# EAGLE design mayfly_platform_reva (EAGLE 7.2.0)
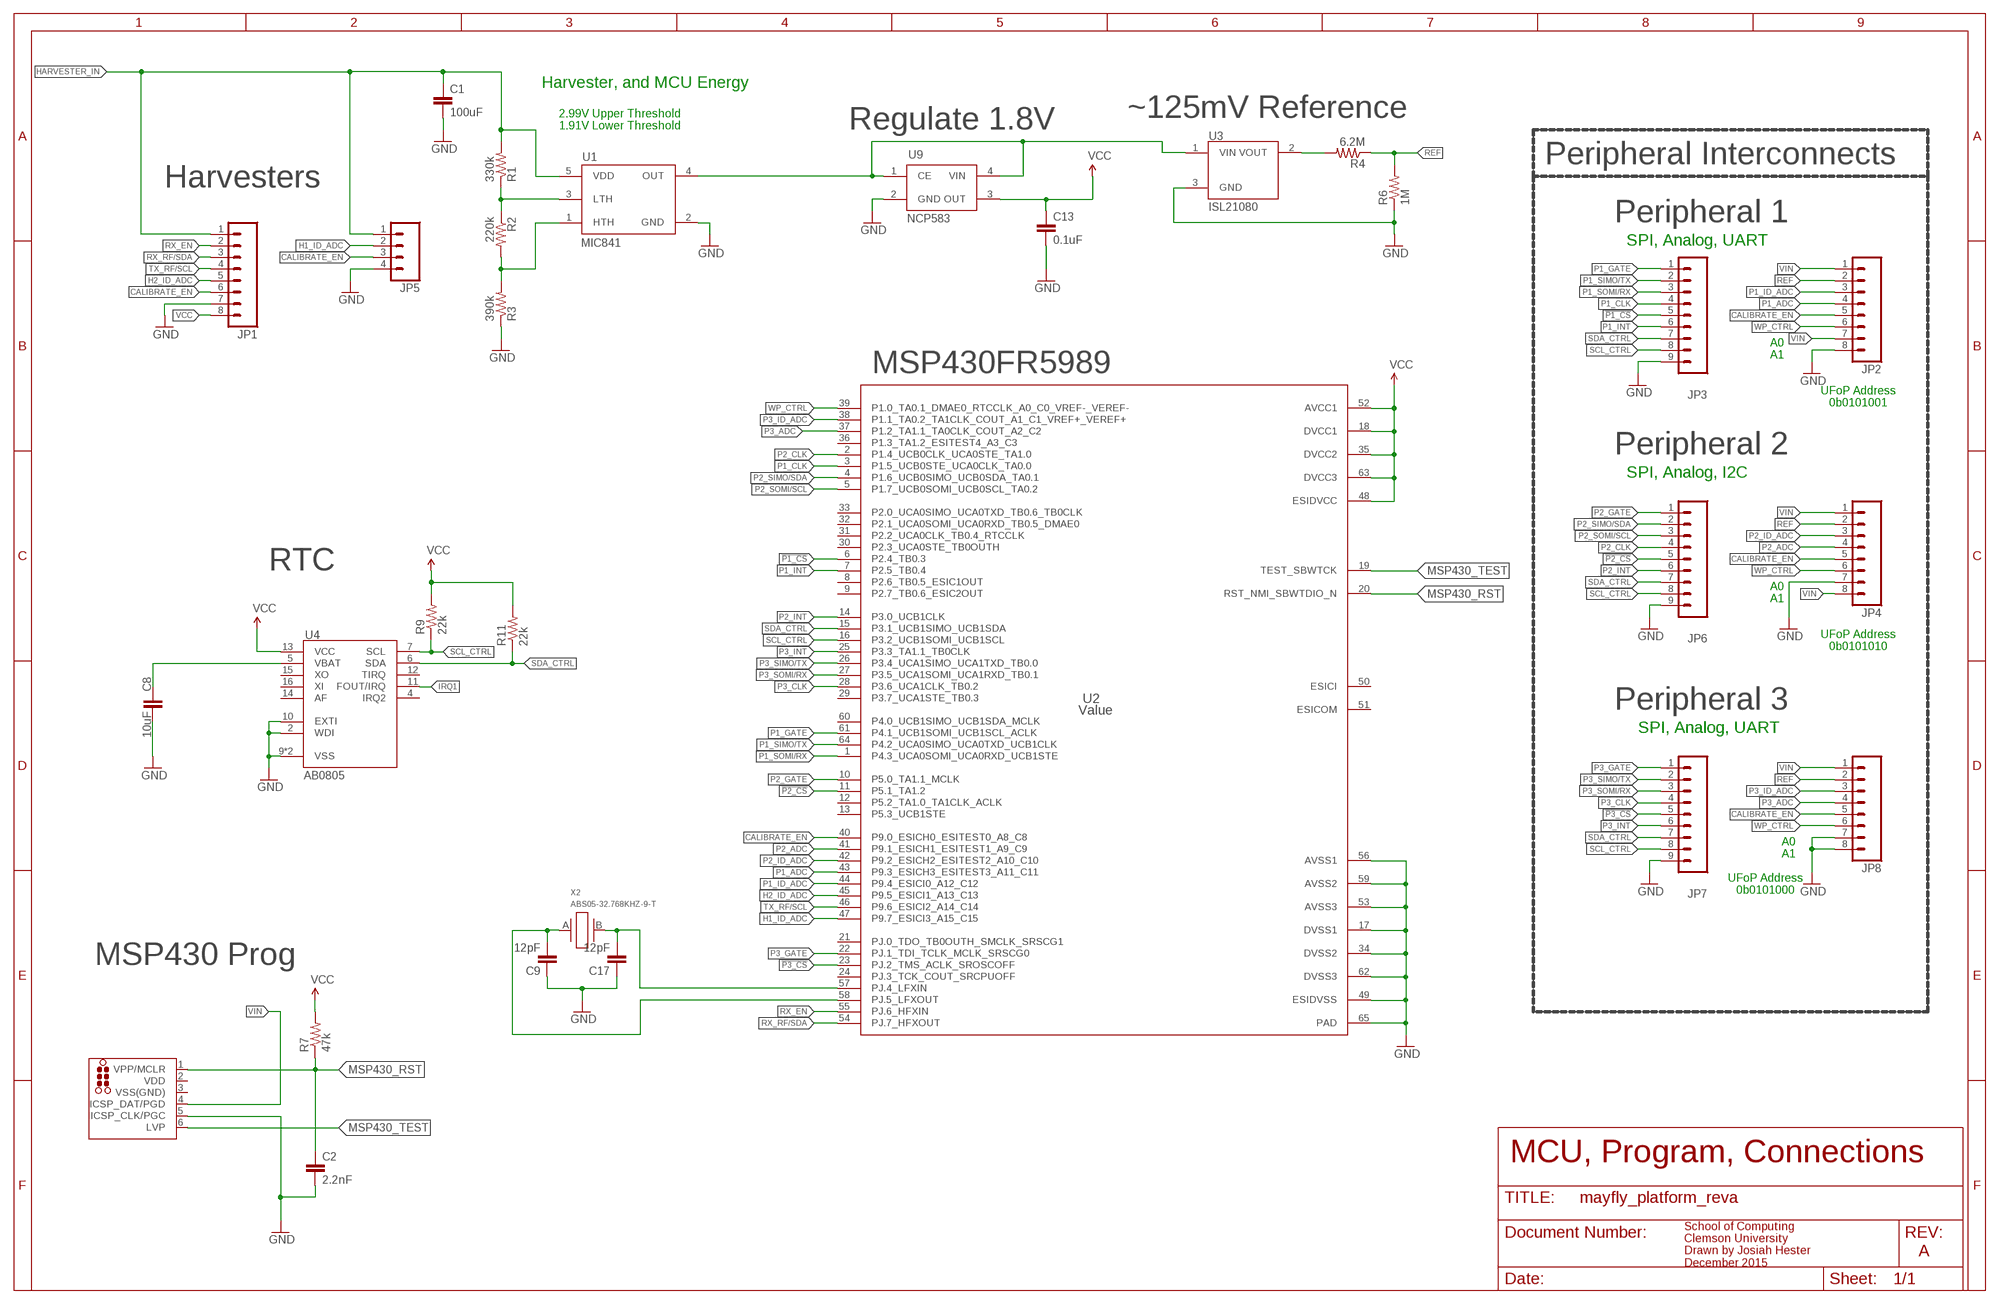
[diagram p0: schematic, sheet 1]

## Parts
C1  100uF  CAP1210  [1210]
C2  2.2nF  C-EU0603  [0603]
C8  10uF  CAP0805  [0805]
C9  12pF  C-EU0603  [0603]
C13  0.1uF  C-EU0603  [0603]
C17  12pF  C-EU0603  [0603]
J1  TC2030-MCP-NL  [TC2030-MCP-NL]
JP1  M081.27MM  [1X08-1.27MM]
JP2  M081.27MM  [1X08-1.27MM]
JP3  M091.27MM  [1X09-1.27MM]
JP4  M081.27MM  [1X08-1.27MM]
JP5  M041.27MM  [1X04-1.27MM]
JP6  M091.27MM  [1X09-1.27MM]
JP7  M091.27MM  [1X09-1.27MM]
JP8  M081.27MM  [1X08-1.27MM]
R1  330k  R-EU0603  [0603]
R2  220k  R-EU0603  [0603]
R3  390k  R-EU0603  [0603]
R4  6.2M  R-EU0603  [0603]
R6  1M  R-EU0603  [0603]
R7  47k  R-EU0603  [0603]
R9  22k  R-EU0603  [0603]
R11  22k  R-EU0603  [0603]
U1  MIC841  [SC70-5]
U2  Value  MSP430FR5989IRGCR  [RGC0064B]
U3  ISL21080  [SOT-23]
U4  AB0805  [QFN16]
U9  NCP583  [SC82-AB_1PRIMARY]
X2  ABS05-32.768KHZ-9-T  [ABS05]

## Nets
!P1_CS: JP3.5 U2.6(P2.4_TB0.3)
!P2_CS: JP6.5 U2.11(P5.1_TA1.2)
!P3_CS: JP7.5 U2.23(PJ.2_TMS_ACLK_SROSCOFF)
CALIBRATE_EN: JP1.6 JP2.5 JP4.5 JP5.3 JP8.5 U2.40(P9.0_ESICH0_ESITEST0_A8_C8)
GND: C1.2 C2.2 C8.2 C9.1 C13.2 C17.1 J1.5(ICSP_CLK/PGC) JP1.7 JP2.8 JP3.9 JP4.7 JP5.4 JP6.9 JP7.9 JP8.7 JP8.8 R3.1 R6.1 U1.2(GND) U2.17(DVSS1) U2.34(DVSS2) U2.49(ESIDVSS) U2.53(AVSS3) U2.56(AVSS1) U2.59(AVSS2) U2.62(DVSS3) U2.65(PAD) U3.3(GND) U4.2(WDI) U4.9(VSS) U4.10(EXTI) U4.TH(VSS) U9.2(GND)
H1_ID_ADC: JP5.2 U2.47(P9.7_ESICI3_A15_C15)
H2_ID_ADC: JP1.5 U2.45(P9.5_ESICI1_A13_C13)
HARVESTER_IN: C1.1 JP1.1 JP5.1 R1.2 U1.5(VDD)
IRQ1: U4.11(FOUT/IRQ)
MSP430_RST: C2.1 J1.1(VPP/MCLR) R7.1 U2.20(RST_NMI_SBWTDIO_N)
MSP430_TEST: J1.6(LVP) U2.19(TEST_SBWTCK)
N$1: R1.1 R2.1 U1.3(LTH)
N$2: R4.2 U3.2(VOUT)
N$3: R2.2 R3.2 U1.1(HTH)
N$5: C17.2 U2.57(PJ.4_LFXIN) X2.B
N$6: C9.2 U2.58(PJ.5_LFXOUT) X2.A
N$8: C8.1 U4.5(VBAT)
P1_ADC: JP2.4 U2.43(P9.3_ESICH3_ESITEST3_A11_C11)
P1_CLK: JP3.4 U2.3(P1.5_UCB0STE_UCA0CLK_TA0.0)
P1_GATE: JP3.1 U2.61(P4.1_UCB1SOMI_UCB1SCL_ACLK)
P1_ID_ADC: JP2.3 U2.44(P9.4_ESICI0_A12_C12)
P1_INT: JP3.6 U2.7(P2.5_TB0.4)
P1_SIMO/TX: JP3.2 U2.64(P4.2_UCA0SIMO_UCA0TXD_UCB1CLK)
P1_SOMI/RX: JP3.3 U2.1(P4.3_UCA0SOMI_UCA0RXD_UCB1STE)
P2_ADC: JP4.4 U2.41(P9.1_ESICH1_ESITEST1_A9_C9)
P2_CLK: JP6.4 U2.2(P1.4_UCB0CLK_UCA0STE_TA1.0)
P2_GATE: JP6.1 U2.10(P5.0_TA1.1_MCLK)
P2_ID_ADC: JP4.3 U2.42(P9.2_ESICH2_ESITEST2_A10_C10)
P2_INT: JP6.6 U2.14(P3.0_UCB1CLK)
P2_SIMO/SDA: JP6.2 U2.4(P1.6_UCB0SIMO_UCB0SDA_TA0.1)
P2_SOMI/SCL: JP6.3 U2.5(P1.7_UCB0SOMI_UCB0SCL_TA0.2)
P3_ADC: JP8.4 U2.37(P1.2_TA1.1_TA0CLK_COUT_A2_C2)
P3_CLK: JP7.4 U2.28(P3.6_UCA1CLK_TB0.2)
P3_GATE: JP7.1 U2.22(PJ.1_TDI_TCLK_MCLK_SRSCG0)
P3_ID_ADC: JP8.3 U2.38(P1.1_TA0.2_TA1CLK_COUT_A1_C1_VREF+_VEREF+)
P3_INT: JP7.6 U2.25(P3.3_TA1.1_TB0CLK)
P3_SIMO/TX: JP7.2 U2.26(P3.4_UCA1SIMO_UCA1TXD_TB0.0)
P3_SOMI/RX: JP7.3 U2.27(P3.5_UCA1SOMI_UCA1RXD_TB0.1)
REF: JP2.2 JP4.2 JP8.2 R4.1 R6.2
RX_EN: JP1.2 U2.55(PJ.6_HFXIN)
RX_RF/SDA: JP1.3 U2.54(PJ.7_HFXOUT)
SCL_CTRL: JP3.8 JP6.8 JP7.8 R9.1 U2.16(P3.2_UCB1SOMI_UCB1SCL) U4.7(SCL)
SDA_CTRL: JP3.7 JP6.7 JP7.7 R11.1 U2.15(P3.1_UCB1SIMO_UCB1SDA) U4.6(SDA)
TX_RF/SCL: JP1.4 U2.46(P9.6_ESICI2_A14_C14)
VCC: C13.1 JP1.8 R7.2 R9.2 R11.2 U2.18(DVCC1) U2.35(DVCC2) U2.48(ESIDVCC) U2.52(AVCC1) U2.63(DVCC3) U4.13(VCC) U9.3(OUT)
VIN: J1.4(ICSP_DAT/PGD) JP2.1 JP2.7 JP4.1 JP4.8 JP8.1 U1.4(OUT) U3.1(VIN) U9.1(CE) U9.4(VIN)
WP_CTRL: JP2.6 JP4.6 JP8.6 U2.39(P1.0_TA0.1_DMAE0_RTCCLK_A0_C0_VREF-_VEREF-)
Unconnected: U2.8(P2.6_TB0.5_ESIC1OUT) U2.9(P2.7_TB0.6_ESIC2OUT) U2.12(P5.2_TA1.0_TA1CLK_ACLK) U2.13(P5.3_UCB1STE) U2.21(PJ.0_TDO_TB0OUTH_SMCLK_SRSCG1) U2.24(PJ.3_TCK_COUT_SRCPUOFF) U2.29(P3.7_UCA1STE_TB0.3) U2.30(P2.3_UCA0STE_TB0OUTH) U2.31(P2.2_UCA0CLK_TB0.4_RTCCLK) U2.32(P2.1_UCA0SOMI_UCA0RXD_TB0.5_DMAE0) U2.33(P2.0_UCA0SIMO_UCA0TXD_TB0.6_TB0CLK) U2.36(P1.3_TA1.2_ESITEST4_A3_C3) U2.50(ESICI) U2.51(ESICOM) U2.60(P4.0_UCB1SIMO_UCB1SDA_MCLK) U4.4(IRQ2) U4.12(TIRQ) U4.14(AF) U4.15(XO) U4.16(XI)

## Notes on the sheet
- Harvester, and MCU Energy
- ~125mV Reference
- 2.99V Upper Threshold
  1.91V Lower Threshold
- Regulate 1.8V
- Peripheral Interconnects
- Harvesters
- Peripheral 1
- SPI, Analog, UART
- A0
  A1
- MSP430FR5989
- UFoP Address
  0b0101001
- Peripheral 2
- SPI, Analog, I2C
- RTC
- A0
  A1
- UFoP Address
  0b0101010
- Peripheral 3
- SPI, Analog, UART
- A0
  A1
- UFoP Address
  0b0101000
- MSP430 Prog
- MCU, Program, Connections
- A
- School of Computing
  Clemson University
  Drawn by Josiah Hester
  December 2015

## Power pins joined to a net without a drawn wire
VDD: J1.2(VDD)
VSS(GND): J1.3(VSS(GND))

## Library data of the parts
C1 = SparkFun-Capacitors:CAP: Capacitor Standard 0603 ceramic capacitor, and 0.1" leaded capacitor.; DIGIKEY: 490-9969-1-ND
C2 C9 C13 C17 = tiny_passives:C-EU
C8 = SparkFun-Capacitors:CAP: Capacitor Standard 0603 ceramic capacitor, and 0.1" leaded capacitor.
J1 = tag-connect_msp430:TC2030: TAG-CONNECT ICSP Connector Manufacturer: Tag-Connect <http://www.tag-connect.com> Cable for easy In-Circuit Serial Programming. Designed for Microchip ICD2, suitable for many others. Two variants - one "with legs" (for hands-free fit on PCB) and another "without legs" for quick programming. PAD Description 1 MCLR/Vpp 2 Vdd 3 GND 4 PGD (ISPDAT) 5 PGC (ISPCLK) 6 nc (used for LVP) ©2009 ROFA.cz - modified and updated by Robert Darlington ‹rdarlington@gmail.com›
JP1 JP2 = SparkFun-Connectors:M08: Header 8 Standard 8-pin 0.1" header. Use with straight break away headers (SKU : PRT-00116), right angle break away headers (PRT-00553), swiss pins (PRT-00743), machine pins (PRT-00117), and female headers (PRT-00115).; DIGIKEY: S9014E-08-ND
JP3 JP6 JP7 = SparkFun-Connectors:M09: Header 9 Standard 9-pin 0.1" header. Use with straight break away headers (SKU : PRT-00116), right angle break away headers (PRT-00553), swiss pins (PRT-00743), machine pins (PRT-00117), and female headers (PRT-00115).
JP4 JP8 = SparkFun-Connectors:M08: Header 8 Standard 8-pin 0.1" header. Use with straight break away headers (SKU : PRT-00116), right angle break away headers (PRT-00553), swiss pins (PRT-00743), machine pins (PRT-00117), and female headers (PRT-00115).
JP5 = SparkFun-Connectors:M04: Header 4 Standard 4-pin 0.1" header. Use with straight break away headers (SKU : PRT-00116), right angle break away headers (PRT-00553), swiss pins (PRT-00743), machine pins (PRT-00117), and female headers (PRT-00115). Molex polarized connector foot print use with SKU : PRT-08231 with associated crimp pins and housings. 1MM SMD Version SKU: PRT-10208
R1 = tiny_passives:R-EU; DIGIKEY: 311-330KGRCT-ND
R2 = tiny_passives:R-EU; DIGIKEY: 311-220KGRCT-ND
R3 = tiny_passives:R-EU; DIGIKEY: 311-390KGRCT-ND
R4 = tiny_passives:R-EU; DIGIKEY: 541-6.20MHCT-ND
R6 = tiny_passives:R-EU; DIGIKEY: 311-1.00MHRCT-ND
R7 R9 R11 = tiny_passives:R-EU
U1 = fedpower:MIC841: MIC841:Comparator with reference and adj. hysteresis; DIGIKEY: 576-2923-1-ND
U2 = msp430fr5989:MSP430FR5989IRGCR; ALTERNATEPARTNUMBER: MSP430FR5989IRGCT; COMPTYPE: IC; DIGIKEY: 296-42031-1-ND; MANUFACTURER: Texas Instruments; MOUNTTYPE: SMT; PACKAGEREFERENCE: RGC0064B; PARTNUMBER: MSP430FR5989IRGCR; PIN_COUNT: 65; REFDES: RefDes; ROHS: Y; TYPE: TYPE
U3 = isl21080:ISL21080: Intersil: ISL21080, 300nA NanoPower Voltage References The ISL21080 analog voltage references feature low supply voltage operation at ultra-low 310nA typ, 1.5µA max operating current. Additionally, the ISL21080 family features guaranteed initial accuracy as low as ±0.2% and 50ppm/°C temperature coefficient. These references are ideal for general purpose portable applications to extend battery life at lower cost. The ISL21080 is provided in the industry standard 3 Ld SOT-23 pinout. The ISL21080 output voltages can be used as precision voltage sources for voltage monitors, control loops, standby voltages for low power states for DSP, FPGA, Datapath Controllers, microcontrollers and other core voltages: 0.9V, 1.024V, 1.25V, 1.5V, 2.048V, 2.5V, 3.0V, 3.3V, 4.096V and 5.0V. Special Note: Post-assembly x-ray inspection may lead to permanent changes in device output voltage and should be minimized or avoided. For further information, please see “Applications Information” on page 14 and AN1533, “X-Ray Effects on Intersil FGA References”.; DIGIKEY: ISL21080DIH309Z-TKCT-ND
U4 = AB08XX:AB0805: AB08X5 Real-Time Clock Family: I2C Version The ABRACON AB08X5 Real-Time Clock family provides a groundbreaking combination of ultra-low power coupled with a highly sophisticated feature set. With power requirements significantly lower than any other industry RTC (as low as 14 nA), these are the first semiconductors based on innovative SPOTTM (Subthreshold Power Optimized Technology) CMOS platform. The AB08X5 includes on-chip oscillators to provide minimum power consumption, full RTC functions including battery backup and programmable counters and alarms for timer and watchdog functions, and either an I2C or SPI serial interface for communication with a host controller.; MOUSER: 815-AB0805-T3
U9 = ncp583:NCP583: NCP583 - Ultra-Low Iq 150 mA CMOS LDO Regulator with Enable The NCP583 series of low dropout regulators are designed for portable battery powered applications which require precise output voltage accuracy and low quiescent current. These devices feature an enable function which lowers current consumption significantly and are offered in two small packages; SC−82AB and the SOT−563. A 1.0 mF ceramic capacitor is the recommended value to be used with these devices on the output pin.; DIGIKEY: NCP583SQ18T1GOSCT-ND
X2 = abs05:ABS05-32.768KHZ: 32.768kHz Crystal; DIGIKEY: 535-11897-1-ND

## Board
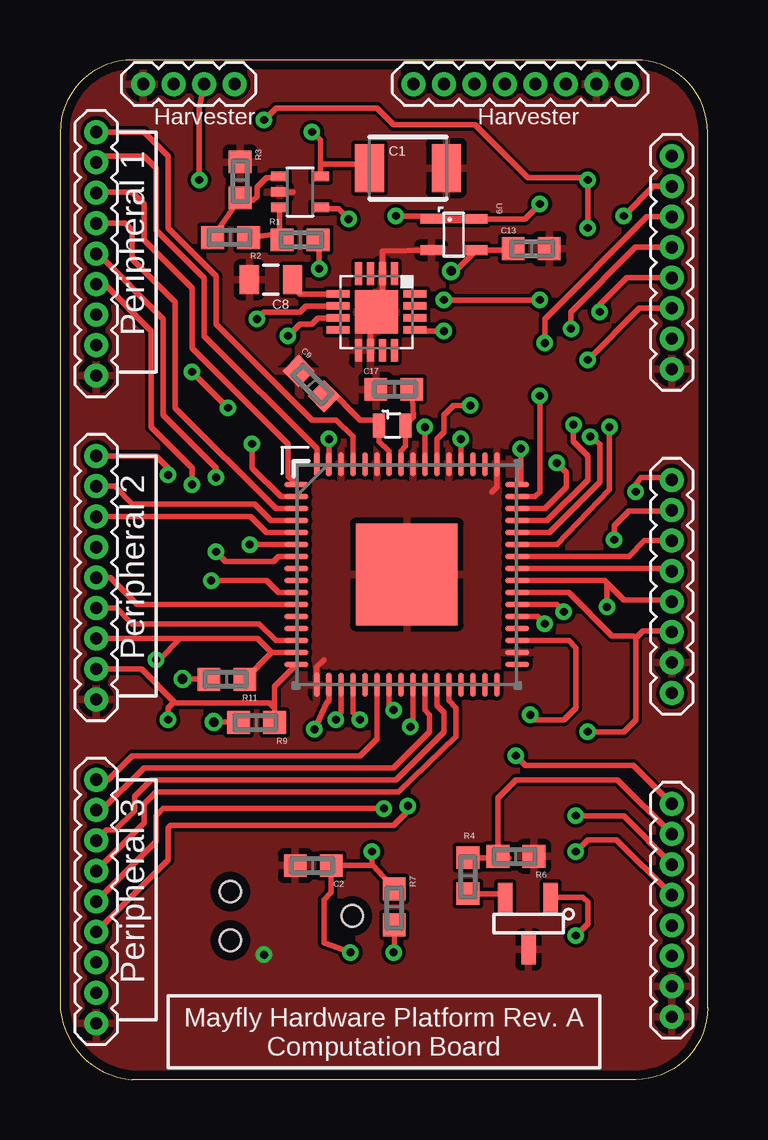
[diagram p1: board, top side]
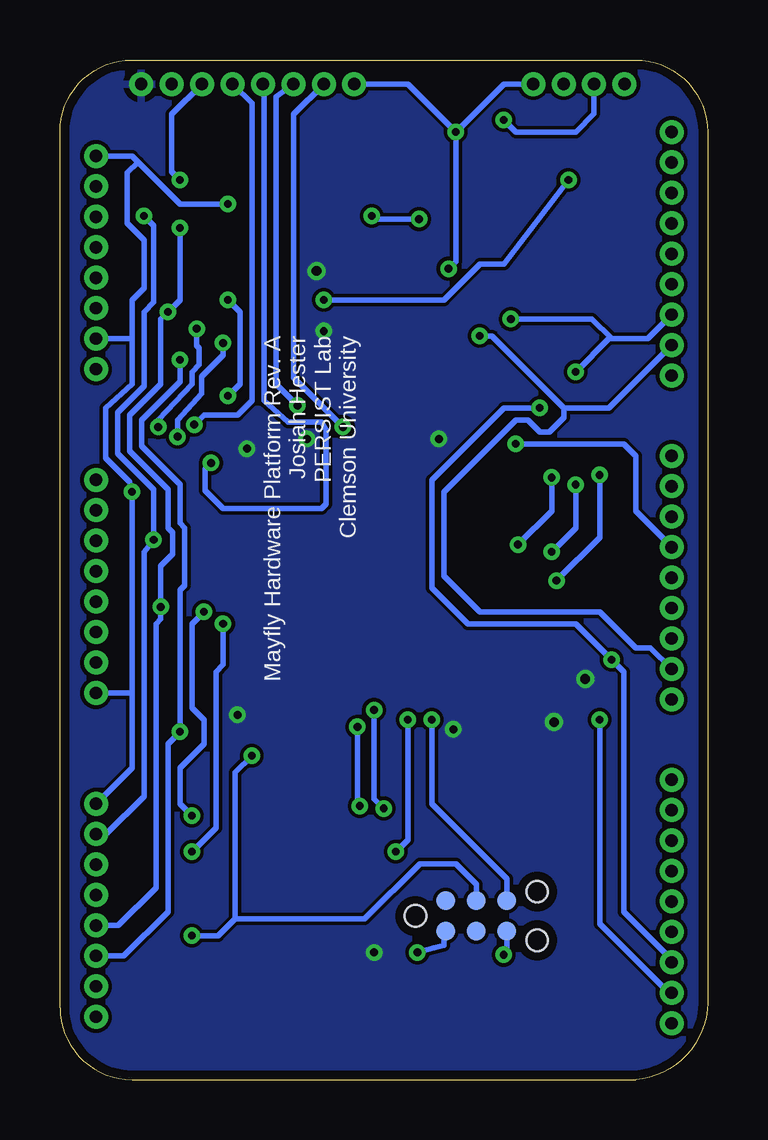
[diagram p2: board, bottom side, seen from below]

Size 27.01 x 42.5 mm. Coordinates in mm from the lower left corner, seen from the top.
Outline: 24.01,42.5 6.01,42.5 3.01,42.5 arc90 0.01,39.5 0.01,3.5 arc90 3.01,0 24.01,0 arc90 27.01,3 27.01,39.5 arc90 24.01,42.5
Copper layers (1*16): Top 0.0356mm / dielectric 1.5011mm / Bottom 0.0356mm
Design rules "LaenPCBOrder": minimum track width 6mil, minimum drill 13mil, track to track 6mil, track to pad 6mil, pad to pad 6mil, via to via 6mil, smd to smd 6mil, copper to edge 15mil, drill to drill 6mil, minimum pad ring 7mil, minimum via ring 7mil, stop-mask expansion 3mil, vias tented up to drill 0mil, thermal gap 10mil

### Footprints (pad centres in the part's own frame; a part is rotated, then mirrored left to right if it is on the bottom)
1210 = smd 1.2 x 2: 1 -1.6,0; 2 1.6,0
0603 = smd 0.95 x 0.95: 1 -0.75,0; 2 0.75,0
0805 = smd 0.8 x 1.2: 1 -0.9,0; 2 0.9,0
TC2030-MCP-NL = smd 0.787 x 0.787: 1 1.27,-0.635; 2 1.27,0.635; 3 2.54,-0.635; 4 2.54,0.635; 5 3.81,-0.635; 6 3.81,0.635 | hole 0.889: 0,0; 5.08,-1.016; 5.08,1.016
1X08-1.27MM = drill 0.508 pad 1: 1 0,0; 2 1.27,0; 3 2.54,0; 4 3.81,0; 5 5.08,0; 6 6.35,0; 7 7.62,0; 8 8.89,0
1X09-1.27MM = drill 0.508 pad 1: 1 0,0; 2 1.27,0; 3 2.54,0; 4 3.81,0; 5 5.08,0; 6 6.35,0; 7 7.62,0; 8 8.89,0; 9 10.16,0
1X04-1.27MM = drill 0.508 pad 1: 1 0,0; 2 1.27,0; 3 2.54,0; 4 3.81,0
SC70-5 = smd 0.4 x 0.7: 1 -0.65,-0.85; 2 0,-0.85; 3 0.65,-0.85; 4 0.65,0.85; 5 -0.65,0.85
RGC0064B = smd 1 x 0.23: 1 -4.6,3.75; 2 -4.6,3.25; 3 -4.6,2.75; 4 -4.6,2.25; 5 -4.6,1.75; 6 -4.6,1.25; 7 -4.6,0.75; 8 -4.6,0.25; 9 -4.6,-0.25; 10 -4.6,-0.75; 11 -4.6,-1.25; 12 -4.6,-1.75; 13 -4.6,-2.25; 14 -4.6,-2.75; 15 -4.6,-3.25; 16 -4.6,-3.75; 33 4.6,-3.75; 34 4.6,-3.25; 35 4.6,-2.75; 36 4.6,-2.25; 37 4.6,-1.75; 38 4.6,-1.25; 39 4.6,-0.75; 40 4.6,-0.25; 41 4.6,0.25; 42 4.6,0.75; 43 4.6,1.25; 44 4.6,1.75; 45 4.6,2.25; 46 4.6,2.75; 47 4.6,3.25; 48 4.6,3.75 | smd 0.23 x 1: 17 -3.751,-4.6; 18 -3.251,-4.6; 19 -2.751,-4.6; 20 -2.251,-4.6; 21 -1.75,-4.6; 22 -1.25,-4.6; 23 -0.75,-4.6; 24 -0.25,-4.6; 25 0.25,-4.6; 26 0.75,-4.6; 27 1.25,-4.6; 28 1.75,-4.6; 29 2.251,-4.6; 30 2.751,-4.6; 31 3.251,-4.6; 32 3.751,-4.6; 49 3.751,4.6; 50 3.251,4.6; 51 2.751,4.6; 52 2.251,4.6; 53 1.75,4.6; 54 1.25,4.6; 55 0.75,4.6; 56 0.25,4.6; 57 -0.25,4.6; 58 -0.75,4.6; 59 -1.25,4.6; 60 -1.75,4.6; 61 -2.251,4.6; 62 -2.751,4.6; 63 -3.251,4.6; 64 -3.751,4.6 | smd 4.242 x 4.242: 65 0,0
SOT-23 = smd 0.6 x 1.25: 1 -0.95,-1.075; 2 0.95,-1.075; 3 -0.025,1.075
QFN16 = smd 0.95 x 0.3: 1 -1.6,0.75; 2 -1.6,0.25; 3 -1.6,-0.25; 4 -1.6,-0.75; 9 1.6,-0.75; 10 1.6,-0.25; 11 1.6,0.25; 12 1.6,0.75 | smd 0.3 x 0.95: 5 -0.75,-1.6; 6 -0.25,-1.6; 7 0.25,-1.6; 8 0.75,-1.6; 13 0.75,1.6; 14 0.25,1.6; 15 -0.25,1.6; 16 -0.75,1.6 | smd 1.8 x 1.8: TH 0,0
SC82-AB_1PRIMARY = smd 0.406 x 0.914: 1 -0.621,-0.913; 2 0.675,-0.913; 3 0.675,0.967; 4 -0.621,0.967
ABS05 = smd 0.5 x 1: A -0.55,0; B 0.55,0

### Placement (x,y rotation side)
C1  14.51,38 0 top
C2  10.56,8.92 180 top
C8  8.8,33.34 180 top
C9  10.48,29.01 315 top
C13  19.65,34.63 0 top
C17  13.92,28.77 0 top
J1  12.19,6.82 0 bottom
JP1  14.74,41.5 0 top
JP2  25.51,38.5 270 top
JP3  1.51,39.5 270 top
JP4  25.51,25 270 top
JP5  7.28,41.5 180 top
JP6  1.51,26 270 top
JP7  1.51,12.5 270 top
JP8  25.51,11.5 270 top
R1  10.01,35 0 top
R2  7.11,35.1 180 top
R3  7.51,37.5 270 top
R4  17.01,8.5 270 top
R6  19.01,9.3 180 top
R7  13.94,7.2 270 top
R9  8.2,14.88 180 top
R11  6.96,16.68 180 top
U1  10.01,37 270 top
U2  14.46,21.05 0 top
U3  19.51,6.5 180 top
U4  13.2,32 270 top
U9  16.4,35.25 270 top
X2  13.86,27.27 0 top

### Tracks (layer width: path | path; a pad name or v marks a point on that pad's centre or on a via)
!P1_CS  (via drill 0.33)
  Top 0.222: v6.51,25.1 6.51,25.5 4.31,27.7 4.31,31.7 1.59,34.42 JP3.5 | v7.91,22.3 U2.6 | U2.6
  Bottom 0.222: v6.51,25.1 6.51,23.7 v7.91,22.3
!P2_CS
  Top 0.222: JP6.5 2.09,20.92 3.21,19.8 U2.11 | U2.11
!P3_CS  (via drill 0.33)
  Top 0.222: U2.23 13.71,15.6 v13.91,15.4 | v13.51,11.3 4.31,11.3 4.01,11 4.01,9.92 JP7.5
  Bottom 0.222: v13.91,15.4 13.91,11.7 v13.51,11.3
CALIBRATE_EN  (via drill 0.33)
  Top 0.222: JP4.5 25.43,20 23.51,20 22.81,20.7 | v22.51,32 22.51,32.3 23.63,33.42 JP2.5 | U2.40 22.71,20.8 22.81,20.7 | 22.81,20.7 v22.81,19.7 | v22.01,35.5 v22.01,37.5 21.91,37.6 19.51,37.6 17.31,39.8 13.91,39.8 13.21,40.5 9.01,40.5 v8.51,40
  Bottom 0.22: 22.36,37.85 22.36,40.23 JP1.6
  Bottom 0.222: JP8.5 24.59,6.42 23.01,8 23.01,19 22.81,19.2 v22.81,19.7 22.81,21.4 22.31,21.9 22.31,22.8 22.51,23 22.51,24.6 24.11,26.2 24.11,27.7 22.81,29 22.81,31.7 v22.51,32 22.01,32.5 v22.01,35.5 | 22.36,37.85 v22.01,37.5 | JP5.3 4.74,40.27 5.51,39.5 8.01,39.5 v8.51,40
GND  (via drill 0.33)
  Top 0.222: U9.2 13.45,34.54 U4.2 13.45,32.25 U4.TH 12.95,31.75 U4.10 | U1.2 9.71,37 | v8.51,5.2 8.51,5 | U2.17 10.71,17.2 11.01,17.5 | U2.49 18.21,24.7 18.01,24.5
  Bottom 0.222: J1.5 8.38,5.33 v8.51,5.2
  pour Top: 0.01,-0.5 28.01,-0.5 28.01,42.5 0.51,42.5
H1_ID_ADC  (via drill 0.33)
  Top 0.222: U2.47 19.81,24.3 20.01,24.5 v20.01,28.5 | v20.01,32.5 v16.01,32.5 | JP5.2 5.81,40.5 v5.81,37.5
  Bottom 0.222: v16.01,32.5 11.01,32.5 9.51,34 8.51,34 v5.81,37.5 | v20.01,32.5 19.51,32 19.51,29 v20.01,28.5
H2_ID_ADC  (via drill 0.33)
  Top 0.222: U2.45 20.31,23.3 22.01,25 22.01,26 21.41,26.6 v21.41,27.3
  Bottom 0.22: 19.01,38.6 19.01,40.69 JP1.5
  Bottom 0.222: 19.01,38.6 19.01,28.3 19.61,27.7 21.01,27.7 v21.41,27.3
HARVESTER_IN  (via drill 0.33)
  Top 0.222: U1.5 10.86,38.15 | v10.81,33.8 10.81,34.95 R1.2 | 10.86,38.15 12.76,38.15 C1.1 | 10.86,38.15 10.86,39.15 v10.51,39.5
  Bottom 0.222: v10.51,39.5 10.51,34.1 v10.81,33.8 | JP5.1 8.51,41.5 v10.51,39.5 | JP1.1 12.51,41.5 v10.51,39.5
MSP430_RST  (via drill 0.33)
  Top 0.222: 13.05,8.92 C2.1 11.31,7.8 11.01,7.5 11.01,5.7 v12.11,5.3 | 13.05,8.92 R7.1 | U2.20 12.21,15.3 v12.51,15 | v13.01,9.5 13.01,8.96 13.05,8.92
  Bottom 0.222: v12.11,5.3 11.41,5.5 11.01,5.6 11.01,6.09 J1.1 | v12.51,15 12.51,10 v13.01,9.5
MSP430_TEST  (via drill 0.33)
  Top 0.222: U2.19 11.71,15.3 v11.51,15
  Bottom 0.222: J1.6 8.38,8.37 11.51,11.5 v11.51,15
N$1
  Top 0.222: U1.3 9.16,35.1 R1.1 9.01,35.25 R2.1
N$2
  Top 0.222: R4.2 18.38,7.75 U3.2
N$3
  Top 0.222: R2.2 R3.2 7.61,36.65 8.06,36.65 8.21,36.8 8.21,37.2 8.61,37.6 9.11,37.6 U1.1
N$5
  Top 0.222: C17.2 14.75,27.61 X2.B 14.41,26.4 14.21,26.2 U2.57 | U2.57
N$6
  Top 0.222: U2.58 13.71,26.2 13.31,26.6 X2.A 13.08,27.5 12.51,27.5 11.23,28.78 C9.2
N$8
  Top 0.222: U4.5 9.99,32.75 C8.1
P1_ADC  (via drill 0.33)
  Top 0.222: U2.43 20.71,22.3 22.91,24.6 v22.91,27.2 | U2.43 | v21.31,31.3 21.31,32 24,34.69 JP2.4
  Bottom 0.222: v22.91,27.2 22.91,27.5 21.51,29 21.51,29.5 21.21,29.8 21.21,30.5 21.31,30.6 v21.31,31.3
P1_CLK
  Top 0.222: U2.3 9.01,23.8 4.81,28 4.81,32.4 3.01,34.2 3.01,35.4 2.71,35.7 JP3.4 | U2.3
P1_GATE
  Top 0.222: U2.61 12.21,26.8 11.51,27.5 10.51,27.5 6.51,31.5 6.51,33.5 4.51,35.5 4.51,38.5 3.51,39.5 JP3.1
P1_ID_ADC  (via drill 0.33)
  Top 0.222: U2.44 20.41,22.8 22.51,24.9 22.51,26.5 v22.11,26.8 | v20.21,30.7 20.21,31.7 24.47,35.96 JP2.3
  Bottom 0.222: v20.21,30.7 20.21,30.2 21.11,29.3 21.11,28.6 22.11,27.5 v22.11,26.8
P1_INT  (via drill 0.33)
  Top 0.222: v5.51,24.8 5.51,25.5 3.81,27.2 3.81,31.2 1.86,33.15 JP3.6 | v6.51,22 6.91,21.6 8.91,21.6 9.11,21.8 U2.7 | U2.7
  Bottom 0.222: v5.51,24.8 5.51,23 v6.51,22
P1_SIMO/TX
  Top 0.222: U2.64 10.71,26.3 6.01,31 6.01,33.4 4.01,35.4 4.01,38 3.51,38.5 1.78,38.5 JP3.2
P1_SOMI/RX
  Top 0.222: U2.1 9.51,25.15 9.51,26.5 5.51,30.5 5.51,33 3.51,35 3.51,36.5 3.01,37 1.55,37 JP3.3
P2_ADC
  Top 0.222: U2.41 25.4,21.3 JP4.4
P2_CLK  (via drill 0.33)
  Top 0.222: U2.2 9.21,24.3 8.01,25.5 v8.01,26.5
  Bottom 0.222: v8.01,26.5 3.51,26.5 3.01,26 3.01,23.69 JP6.4
P2_GATE  (via drill 0.33)
  Top 0.222: JP6.1 4.01,26 4.51,25.5 v4.51,25.2 | v6.31,20.8 8.61,20.8 9.11,20.3 U2.10 | U2.10
  Bottom 0.222: v4.51,25.2 4.51,22.6 v6.31,20.8
P2_ID_ADC
  Top 0.222: JP4.3 24.37,22.46 23.71,21.8 U2.42 | U2.42
P2_INT
  Top 0.222: JP6.6 2.36,19.65 3.01,19 8.31,19 9.01,18.3 U2.14 | U2.14
P2_SIMO/SDA
  Top 0.222: U2.4 8.81,23.3 8.11,24 3.01,24 2.28,24.73 JP6.2 | U2.4
P2_SOMI/SCL
  Top 0.222: JP6.3 7.95,23.46 8.61,22.8 U2.5 | U2.5
P3_ADC  (via drill 0.33)
  Top 0.222: v21.51,9.5 22.01,10 23.2,10 JP8.4 | v20.21,19 19.91,19.3 U2.37 | U2.37
  Bottom 0.222: v21.51,9.5 20.51,10.5 20.51,17 20.21,17.3 v20.21,19
P3_CLK
  Top 0.222: U2.28 16.21,15.8 16.51,15.5 16.51,14.3 14.11,12 4.01,12 3.51,11.5 3.51,10.69 JP7.4
P3_GATE
  Top 0.222: U2.22 13.21,14.2 12.51,13.5 3.01,13.5 2.01,12.5 JP7.1 | U2.22
P3_ID_ADC  (via drill 0.33)
  Top 0.222: U2.38 20.71,19.8 v21.01,19.5 | v21.51,11 23.51,11 24.51,10 24.51,9.96 JP8.3
  Bottom 0.222: v21.01,19.5 21.51,19 21.51,15.5 21.01,15 21.01,14 22.01,13 22.01,11.5 v21.51,11
P3_INT  (via drill 0.33)
  Top 0.222: U2.25 14.71,14.9 v14.61,14.7 | v14.51,11.4 14.51,11.2 13.91,10.6 4.61,10.6 4.51,10.5 4.51,9.15 JP7.6
  Bottom 0.222: v14.61,14.7 14.61,11.6 v14.51,11.4
P3_SIMO/TX
  Top 0.222: U2.26 | U2.26 15.21,15.4 15.41,15.2 15.41,14.5 13.91,13 3.51,13 1.74,11.23 JP7.2
P3_SOMI/RX
  Top 0.222: U2.27 15.71,15.6 16.01,15.3 16.01,14.5 14.01,12.5 3.81,12.5 3.11,11.8 3.11,11.2 2.31,10.4 1.95,10.4 JP7.3 | U2.27
REF  (via drill 0.33)
  Top 0.222: v23.11,22.5 23.11,23.1 23.71,23.7 25.48,23.7 JP4.2 | R4.1 18.71,9.25 R6.2 18.26,11.75 19.01,12.5 23.24,12.5 JP8.2 | JP2.2 24.74,37.23 v23.51,36
  Bottom 0.222: v23.51,36 23.11,35.6 23.11,32.4 23.51,32 23.51,28.9 24.61,27.8 24.61,26.1 23.11,24.6 v23.11,22.5 23.51,22 23.51,11.8 25.08,10.23 JP8.2
RX_EN  (via drill 0.33)
  Top 0.222: v15.21,27.2 U2.55 | U2.55
  Bottom 0.22: 17.28,29.27 17.28,40.23 JP1.2
  Bottom 0.222: 17.28,29.27 v15.21,27.2
RX_RF/SDA  (via drill 0.33)
  Top 0.222: U2.54 15.71,26.7 16.01,27 16.01,27.7 16.41,28.1 v17.11,28.1
  Bottom 0.222: v17.11,28.1 18.01,29 18.01,40.96 JP1.3
SCL_CTRL  (via drill 0.33)
  Top 0.222: U2.16 8.95,16.39 8.95,15.5 | 8.95,15.5 R9.1 | JP6.8 3.4,17.11 4.76,15.75 | 4.76,15.75 4.81,15.7 8.75,15.7 8.95,15.5 | v4.51,15 4.51,15.5 4.76,15.75 | U4.7 10.76,31.75 10.51,31.5 10.01,31.5 v9.51,31
  Bottom 0.222: v4.51,15 4.51,6.5 1.62,3.61 JP7.8 | JP6.8 2.4,18 3.01,18 4.51,19.5 9.51,19.5 11.01,21 11.01,24.5 8.01,27.5 7.51,27.5 7.01,27 6.61,27 6.01,27.6 6.01,28 | v9.51,31 9.01,31 6.01,28 | JP3.8 4.12,28 6.01,28
SDA_CTRL  (via drill 0.33)
  Top 0.222: U2.15 8.83,17.8 | 8.83,17.8 R11.1 | JP6.7 5.01,18.38 | 5.01,18.38 8.25,18.38 8.83,17.8 | v4.01,17.5 4.13,17.5 5.01,18.38 | U4.6 10.26,32.25 10.01,32 8.51,32 v8.21,31.7 | v5.51,29.5 v7.01,28
  Bottom 0.222: 4.01,30.88 4.13,30.88 v5.51,29.5 | v7.01,28 8.51,28 11.51,25 11.51,20.5 10.01,19 5.51,19 v4.01,17.5 3.51,17 3.51,7 1.51,5 JP7.7 | v8.21,31.7 4.83,31.7 4.01,30.88 | JP3.7 2.51,30.88 4.01,30.88
TX_RF/SCL  (via drill 0.33)
  Top 0.222: U2.46 20.21,23.8 21.11,24.7 21.11,25.3 v20.71,25.7 | U2.46
  Bottom 0.22: JP1.4 18.55,41.13 18.51,41.09
  Bottom 0.222: 18.51,41.09 18.51,28.3 17.51,27.4 16.11,27.4 15.91,27.1 15.91,24 16.11,23.8 20.21,23.8 20.96,24.55 20.96,25.45 v20.71,25.7
VCC  (via drill 0.33, 0.4)
  Top 0.222: v5.11,16.7 6.19,16.7 R11.2 | v6.41,14.9 7.43,14.9 R9.2 | v10.61,14.6 11.11,15.7 11.21,15.8 U2.18 | U2.48 19.21,24.8 v19.21,26.3 | v16.71,26.7 16.71,26.8 U2.52 | v11.21,26.7 U2.63 | v16.31,33.7 16.49,33.7 U9.3 18.84,34.58 C13.1 | U2.35 21.21,18.3 21.51,18 21.51,15.5 21.01,15 19.81,15 v19.61,15.2 | v16.01,31.2 14.85,31.2 U4.13 | R7.2 13.94,5.57 v13.91,5.3
  pour Bottom: 0.01,-0.5 27.51,0 28.01,42.5 0.51,42.5
VIN  (via drill 0.33)
  Top 0.222: v24.01,24.5 24.01,24.8 24.21,25.1 25.41,25.1 JP4.1 | v12.04,35.87 11.61,36.3 10.91,36.3 U1.4 | 15.38,35.87 16.01,35.87 15.88,36 v14.01,36 | 19.81,36.3 v20.01,36.5 19.38,35.87 U9.4 | JP8.1 23.91,13.1 19.41,13.1 v19.01,13.5 | v21.51,6 22.01,6.5 22.01,7.4 21.81,7.6 20.48,7.6 U3.1
  Top 0.333: U9.1 16.01,35.87 U9.4
  Bottom 0.222: 24.01,16.11 24.01,13 JP8.1 | 24.01,16.11 v24.01,24.5 24.11,24.9 25.11,25.9 25.11,28 24.01,29 24.01,30.88 | 24.01,30.88 24.01,32.5 23.51,33 23.51,35 24.21,35.7 24.21,37.8 23.76,38.25 | v20.01,36.5 22.01,36.5 23.76,38.25 | v12.04,35.87 13.88,35.87 v14.01,36 | 23.76,38.25 24.01,38.5 JP2.1 | JP4.8 24.01,16.11 | JP2.7 24.01,30.88 | v19.01,13.5 19.71,12.8 19.71,6.7 | 19.71,6.7 20.41,6 v21.51,6 | J1.4 9.65,8.14 10.51,9 12.01,9 14.31,6.7 19.71,6.7
WP_CTRL  (via drill 0.33)
  Top 0.222: JP4.6 25.46,18.7 24.31,18.7 24.01,18.4 | v22.01,30 24.16,32.15 JP2.6 | U2.39 21.21,20.3 23.01,18.5 23.91,18.5 24.01,18.4 | v22.01,14.5 23.51,14.5 24.01,15 24.01,18.4
  Bottom 0.222: v22.01,30 22.01,29.1 23.61,27.5 23.61,26.4 22.01,24.8 22.01,23.2 21.81,23 21.81,20.6 22.01,20.4 v22.01,14.5 22.51,14 22.51,7 24.36,5.15 JP8.6

### Text on the board
tPlace: Harvester | Harvester | Peripheral 1 | Peripheral 2 | Peripheral 3 | Mayfly Hardware Platform Rev. A / Computation Board
bPlace: Mayfly Hardware Platform Rev. A / Josiah Hester / PERSIST Lab / Clemson University